# Altium schematic sheet IOTM-222B.SchDoc
size A3
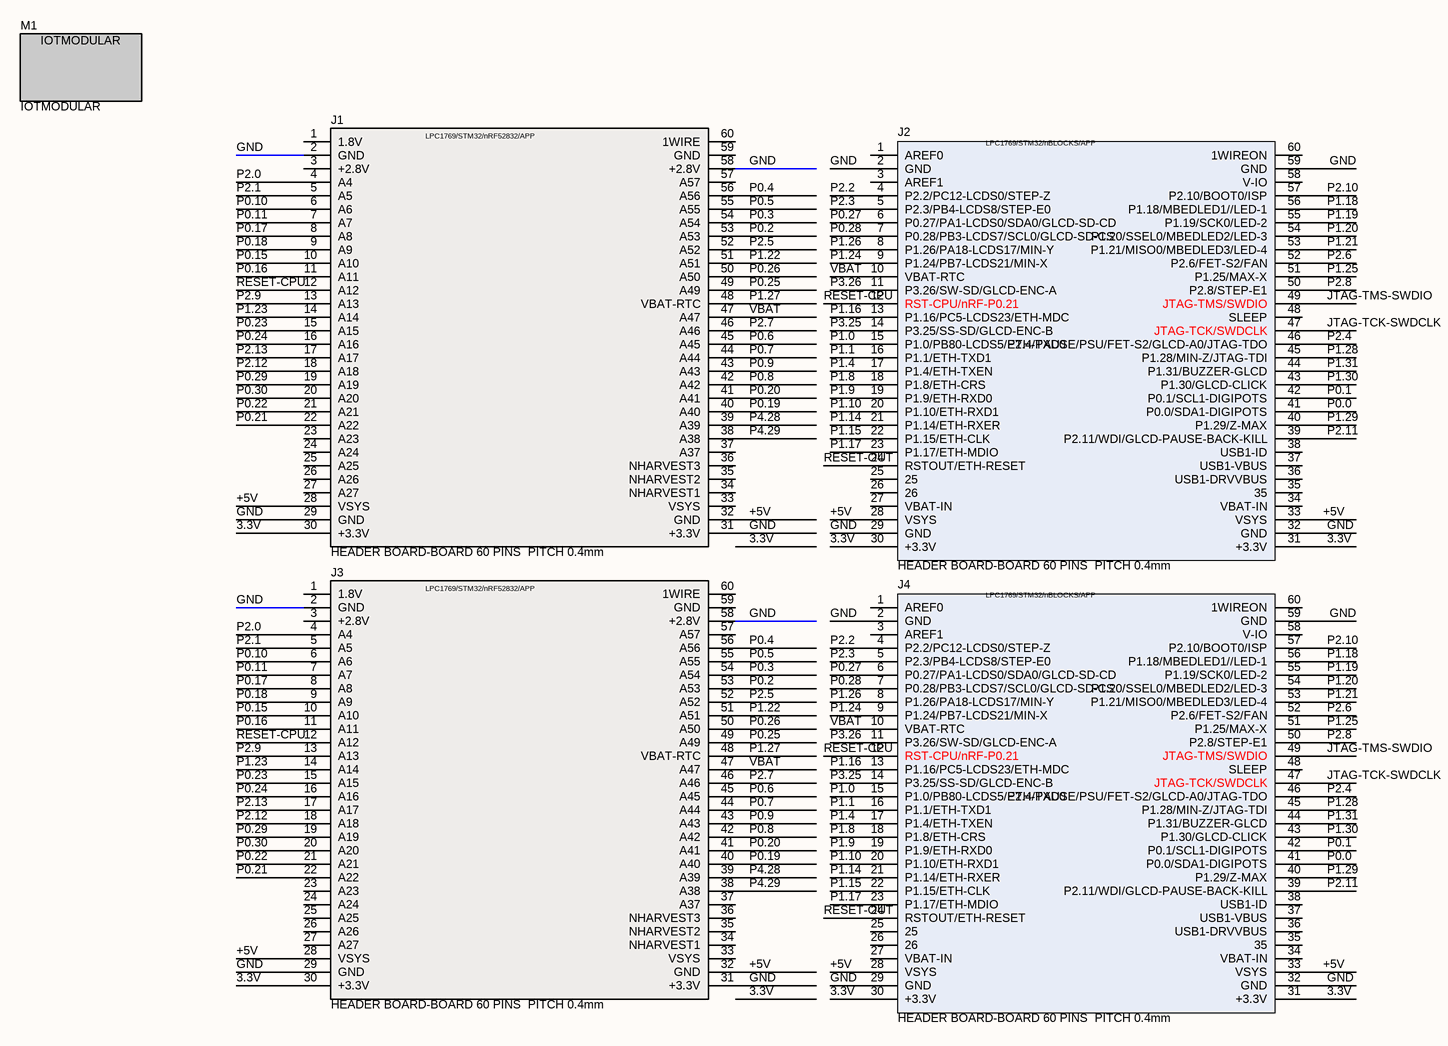
[diagram p0: IOTM-222B.SchDoc]

## Parts
J1  HEADER BOARD-BOARD 60 PINS  PITCH 0.4mm  [IOT-HIROSE-FX6-60S-0.8SV(71)-TOP]
J2  HEADER BOARD-BOARD 60 PINS  PITCH 0.4mm  [IOT-HIROSE-FX6-60P-0.8SV(71)-TOP]
J3  HEADER BOARD-BOARD 60 PINS  PITCH 0.4mm  [IOT-HIROSE-FX6-60P-0.8SV(71)-TOP]
J4  HEADER BOARD-BOARD 60 PINS  PITCH 0.4mm  [IOT-HIROSE-FX6-60S-0.8SV(71)-TOP]
M1  IOTMODULAR  [IOTMODULAR]  (no BOM)

## Nets
3.3V: J1.30(+3.3V) J2.30(+3.3V) J2.31(+3.3V) J3.30(+3.3V) J4.30(+3.3V) J4.31(+3.3V)
+5V: J1.28(VSYS) J1.32(GND) J2.28(VSYS) J2.33(VSYS) J3.28(VSYS) J3.32(GND) J4.28(VSYS) J4.33(VSYS)
GND: J1.2(GND) J1.29(GND) J1.31(+3.3V) J1.58(+2.8V) J2.2(GND) J2.29(GND) J2.32(GND) J2.59(GND) J3.2(GND) J3.29(GND) J3.31(+3.3V) J3.58(+2.8V) J4.2(GND) J4.29(GND) J4.32(GND) J4.59(GND)
JTAG-TCK-SWDCLK: J2.47(JTAG-TCK/SWDCLK) J4.47(JTAG-TCK/SWDCLK)
JTAG-TMS-SWDIO: J2.49(JTAG-TMS/SWDIO) J4.49(JTAG-TMS/SWDIO)
P0.0: J2.41(P0.0/SDA1-DIGIPOTS) J4.41(P0.0/SDA1-DIGIPOTS)
P0.1: J2.42(P0.1/SCL1-DIGIPOTS) J4.42(P0.1/SCL1-DIGIPOTS)
P0.2: J1.53(A53) J3.53(A53)
P0.3: J1.54(A54) J3.54(A54)
P0.4: J1.56(A56) J3.56(A56)
P0.5: J1.55(A55) J3.55(A55)
P0.6: J1.45(A45) J3.45(A45)
P0.7: J1.44(A44) J3.44(A44)
P0.8: J1.42(A42) J3.42(A42)
P0.9: J1.43(A43) J3.43(A43)
P0.10: J1.6(A6) J3.6(A6)
P0.11: J1.7(A7) J3.7(A7)
P0.15: J1.10(A10) J3.10(A10)
P0.16: J1.11(A11) J3.11(A11)
P0.17: J1.8(A8) J3.8(A8)
P0.18: J1.9(A9) J3.9(A9)
P0.19: J1.40(A40) J3.40(A40)
P0.20: J1.41(A41) J3.41(A41)
P0.21: J1.22(A22) J3.22(A22)
P0.22: J1.21(A21) J3.21(A21)
P0.23: J1.15(A15) J3.15(A15)
P0.24: J1.16(A16) J3.16(A16)
P0.25: J1.49(A49) J3.49(A49)
P0.26: J1.50(A50) J3.50(A50)
P0.27: J2.6(P0.27/PA1-LCDS0/SDA0/GLCD-SD-CD) J4.6(P0.27/PA1-LCDS0/SDA0/GLCD-SD-CD)
P0.28: J2.7(P0.28/PB3-LCDS7/SCL0/GLCD-SD-CS) J4.7(P0.28/PB3-LCDS7/SCL0/GLCD-SD-CS)
P0.29: J1.19(A19) J3.19(A19)
P0.30: J1.20(A20) J3.20(A20)
P1.0: J2.15(P1.0/PB80-LCDS5/ETH-TXD0) J4.15(P1.0/PB80-LCDS5/ETH-TXD0)
P1.1: J2.16(P1.1/ETH-TXD1) J4.16(P1.1/ETH-TXD1)
P1.4: J2.17(P1.4/ETH-TXEN) J4.17(P1.4/ETH-TXEN)
P1.8: J2.18(P1.8/ETH-CRS) J4.18(P1.8/ETH-CRS)
P1.9: J2.19(P1.9/ETH-RXD0) J4.19(P1.9/ETH-RXD0)
P1.10: J2.20(P1.10/ETH-RXD1) J4.20(P1.10/ETH-RXD1)
P1.14: J2.21(P1.14/ETH-RXER) J4.21(P1.14/ETH-RXER)
P1.15: J2.22(P1.15/ETH-CLK) J4.22(P1.15/ETH-CLK)
P1.16: J2.13(P1.16/PC5-LCDS23/ETH-MDC) J4.13(P1.16/PC5-LCDS23/ETH-MDC)
P1.17: J2.23(P1.17/ETH-MDIO) J4.23(P1.17/ETH-MDIO)
P1.18: J2.56(P1.18/MBEDLED1//LED-1) J4.56(P1.18/MBEDLED1//LED-1)
P1.19: J2.55(P1.19/SCK0/LED-2) J4.55(P1.19/SCK0/LED-2)
P1.20: J2.54(P1.20/SSEL0/MBEDLED2/LED-3) J4.54(P1.20/SSEL0/MBEDLED2/LED-3)
P1.21: J2.53(P1.21/MISO0/MBEDLED3/LED-4) J4.53(P1.21/MISO0/MBEDLED3/LED-4)
P1.22: J1.51(A51) J3.51(A51)
P1.23: J1.14(A14) J3.14(A14)
P1.24: J2.9(P1.24/PB7-LCDS21/MIN-X) J4.9(P1.24/PB7-LCDS21/MIN-X)
P1.25: J2.51(P1.25/MAX-X) J4.51(P1.25/MAX-X)
P1.26: J2.8(P1.26/PA18-LCDS17/MIN-Y) J4.8(P1.26/PA18-LCDS17/MIN-Y)
P1.27: J1.48(VBAT-RTC) J3.48(VBAT-RTC)
P1.28: J2.45(P1.28/MIN-Z/JTAG-TDI) J4.45(P1.28/MIN-Z/JTAG-TDI)
P1.29: J2.40(P1.29/Z-MAX) J4.40(P1.29/Z-MAX)
P1.30: J2.43(P1.30/GLCD-CLICK) J4.43(P1.30/GLCD-CLICK)
P1.31: J2.44(P1.31/BUZZER-GLCD) J4.44(P1.31/BUZZER-GLCD)
P2.0: J1.4(A4) J3.4(A4)
P2.1: J1.5(A5) J3.5(A5)
P2.2: J2.4(P2.2/PC12-LCDS0/STEP-Z) J4.4(P2.2/PC12-LCDS0/STEP-Z)
P2.3: J2.5(P2.3/PB4-LCDS8/STEP-E0) J4.5(P2.3/PB4-LCDS8/STEP-E0)
P2.4: J2.46(P2.4/PAUSE/PSU/FET-S2/GLCD-A0/JTAG-TDO) J4.46(P2.4/PAUSE/PSU/FET-S2/GLCD-A0/JTAG-TDO)
P2.5: J1.52(A52) J3.52(A52)
P2.6: J2.52(P2.6/FET-S2/FAN) J4.52(P2.6/FET-S2/FAN)
P2.7: J1.46(A46) J3.46(A46)
P2.8: J2.50(P2.8/STEP-E1) J4.50(P2.8/STEP-E1)
P2.9: J1.13(A13) J3.13(A13)
P2.10: J2.57(P2.10/BOOT0/ISP) J4.57(P2.10/BOOT0/ISP)
P2.11: J2.39(P2.11/WDI/GLCD-PAUSE-BACK-KILL) J4.39(P2.11/WDI/GLCD-PAUSE-BACK-KILL)
P2.12: J1.18(A18) J3.18(A18)
P2.13: J1.17(A17) J3.17(A17)
P3.25: J2.14(P3.25/SS-SD/GLCD-ENC-B) J4.14(P3.25/SS-SD/GLCD-ENC-B)
P3.26: J2.11(P3.26/SW-SD/GLCD-ENC-A) J4.11(P3.26/SW-SD/GLCD-ENC-A)
P4.28: J1.39(A39) J3.39(A39)
P4.29: J1.38(A38) J3.38(A38)
RESET-CPU: J1.12(A12) J2.12(RST-CPU/nRF-P0.21) J3.12(A12) J4.12(RST-CPU/nRF-P0.21)
RESET-OUT: J2.24(RSTOUT/ETH-RESET) J4.24(RSTOUT/ETH-RESET)
VBAT: J1.47(A47) J2.10(VBAT-RTC) J3.47(A47) J4.10(VBAT-RTC)

Not connected (* = marked no-connect by the designer): J1 1(1.8V) 3(+2.8V) 23(A23) 24(A24) 25(A25) 26(A26) 27(A27) 33(VSYS) 34(NHARVEST1) 35(NHARVEST2) 36(NHARVEST3) 37(A37) 57(A57) 59(GND) 60(1WIRE); J2 1(AREF0) 3(AREF1) 25 26 27(VBAT-IN) 34(VBAT-IN) 35 36(USB1-DRVVBUS) 37(USB1-VBUS) 38(USB1-ID) 48(SLEEP) 58(V-IO) 60(1WIREON); J3 1(1.8V) 3(+2.8V) 23(A23) 24(A24) 25(A25) 26(A26) 27(A27) 33(VSYS) 34(NHARVEST1) 35(NHARVEST2) 36(NHARVEST3) 37(A37) 57(A57) 59(GND) 60(1WIRE); J4 1(AREF0) 3(AREF1) 25 26 27(VBAT-IN) 34(VBAT-IN) 35 36(USB1-DRVVBUS) 37(USB1-VBUS) 38(USB1-ID) 48(SLEEP) 58(V-IO) 60(1WIREON)

## Notes on the sheet
- (in symbol HEADER 60-NBUS-A) LPC1769/STM32/nRF52832/APP
- (in symbol HEADER 60-NBUS-B) LPC1769/STM32/nBLOCKS/APP

## Library data of the parts
J1 J3 = HEADER 60-NBUS-A: S.Description: CONN RCPT 60POS 0.4MM SMD GOLD; ComponentLink1URL: http://www.molex.com/pdm_docs/sd/5037726010_sd.pdf?src-supplier=Digi-Key; ComponentLink1Description: http://www.molex.com/pdm_docs/sd/5037726010_sd.pdf?src-supplier=Digi-Key
J2 J4 = HEADER 60-NBUS-B